# EAGLE schematic sub-unit-and-psu (EAGLE 9.6.2)
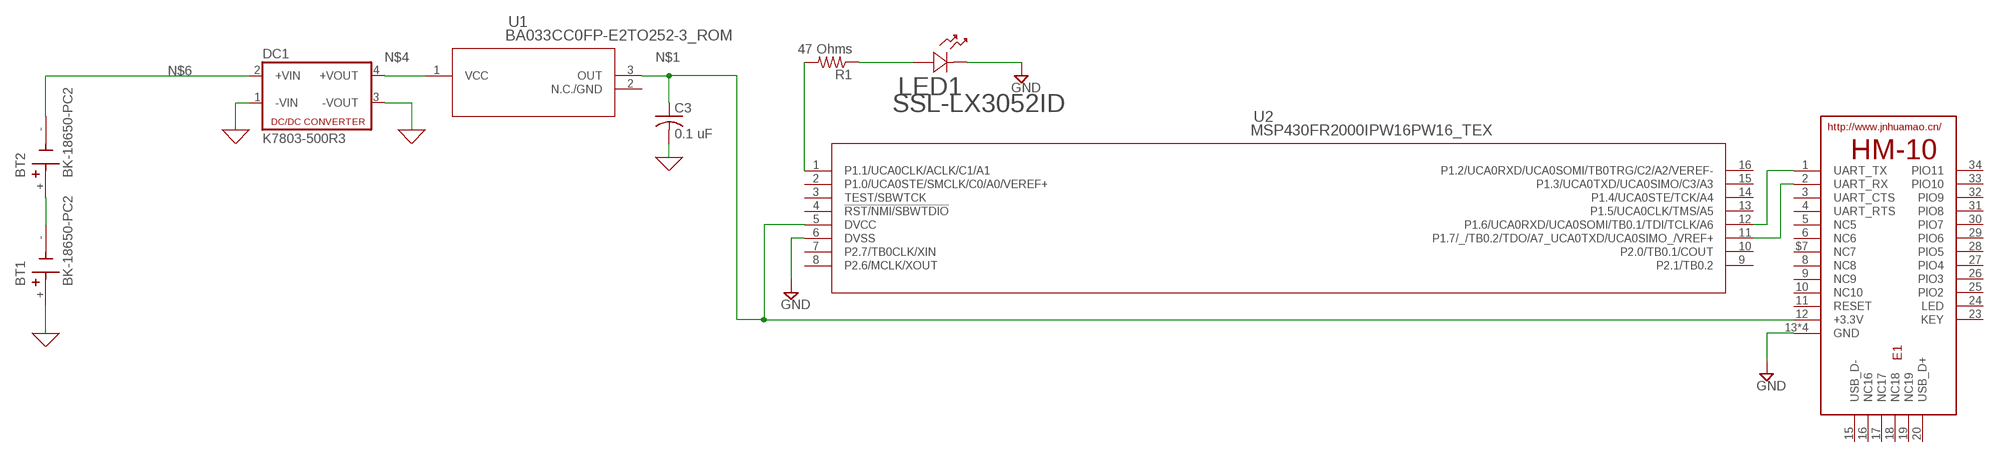
[diagram p0: schematic, sheet 1]

## Parts
BT1  BK-18650-PC2  [BAT_BK-18650-PC2]
BT2  BK-18650-PC2  [BAT_BK-18650-PC2]
C3  0.1 uF  C-US050-024X044  [C050-024X044]
DC1  K7803-500R3  NME  [NME]
E1  HM-10-BOARD  [26.9X13X2.2_BOARD]
LED1  SSL-LX3052ID  [LED_SSL-LX30_T-3_LUM]
R1  47 Ohms  R-US_0204/5  [0204/5]
U1  BA033CC0FP-E2TO252-3_ROM  [TO252-3_ROM]
U2  MSP430FR2000IPW16PW16_TEX  [PW16_TEX]

## Nets
0: BT1.+ C3.2 DC1.1(-VIN) DC1.3(-VOUT) ; supply symbol labelled GND
GND: E1.13(GND) E1.14(GND) E1.21(GND) E1.22(GND) LED1.1(ANODE) U2.6(DVSS)
N$1: C3.1 E1.12(+3.3V) U1.3(OUT) U2.5(DVCC)
N$2: BT1.- BT2.+
N$3: LED1.2 R1.1
N$4: DC1.4(+VOUT) U1.1(VCC)
N$5: E1.1(UART_TX) U2.12(P1.6/UCA0RXD/UCA0SOMI/TB0.1/TDI/TCLK/A6)
N$6: BT2.- DC1.2(+VIN)
N$7: E1.2(UART_RX) U2.11(P1.7/_/TB0.2/TDO/A7_UCA0TXD/UCA0SIMO_/VREF+)
N$8: R1.2 U2.1(P1.1/UCA0CLK/ACLK/C1/A1)
Unconnected: E1.3(UART_CTS) E1.4(UART_RTS) E1.5(NC5) E1.6(NC6) E1.8(NC8) E1.9(NC9) E1.10(NC10) E1.11(RESET) E1.15(USB_D-) E1.16(NC16) E1.17(NC17) E1.18(NC18) E1.19(NC19) E1.20(USB_D+) E1.23(KEY) E1.24(LED) E1.25(PIO2) E1.26(PIO3) E1.27(PIO4) E1.28(PIO5) E1.29(PIO6) E1.30(PIO7) E1.31(PIO8) E1.32(PIO9) E1.33(PIO10) E1.34(PIO11) E1.$7(NC7) U1.2(N.C./GND) U2.2(P1.0/UCA0STE/SMCLK/C0/A0/VEREF+) U2.3(TEST/SBWTCK) U2.4(!RST/NMI/SBWTDIO) U2.7(P2.7/TB0CLK/XIN) U2.8(P2.6/MCLK/XOUT) U2.9(P2.1/TB0.2) U2.10(P2.0/TB0.1/COUT) U2.13(P1.5/UCA0CLK/TMS/A5) U2.14(P1.4/UCA0STE/TCK/A4) U2.15(P1.3/UCA0TXD/UCA0SIMO/C3/A3) U2.16(P1.2/UCA0RXD/UCA0SOMI/TB0TRG/C2/A2/VEREF-)

## Library data of the parts
BT1 BT2 = BK-18650-PC2:BK-18650-PC2: Battery Holder (Open) 18650 1 Cell PC Pin Check availability <https://pricing.snapeda.com/parts/BK-18650-PC2/MPD%20%28Memory%20Protection%20Devices%29/view-part?ref=eda>; AVAILABILITY: In Stock; DESCRIPTION: Battery Holder (Open) 18650 1 Cell PC Pin; MF: MPD (Memory Protection Devices); MP: BK-18650-PC2; PACKAGE: None; PRICE: None; PURCHASE-URL: https://pricing.snapeda.com/search/part/BK-18650-PC2/?ref=eda
C3 = rcl:C-US: CAPACITOR, American symbol; SPICEPREFIX: C
DC1 = dc-dc-converter:NME: DC-DC CONVERTER; MF: C & D TECHNOLOGIES, INC; MPN: NME1205D; OC_FARNELL: 1021466; OC_NEWARK: 98B8198
E1 = HM-10 Bluetooth Module:HM-10: HM Bluetooth module use TI CC2540 or CC2541, Master and slave roles in one, transmission version and remote control version and PIO state acquisition functions in one, Support the AT command modify module parameters, Convenient and flexible. Check availability <https://pricing.snapeda.com/parts/HM-10/Jinan%20Huamao%20Technology/view-part?ref=eda>; AVAILABILITY: Not in stock; DESCRIPTION: Bluetooth 4.0 module with 4pin base board that can support iphone4s or later.; MF: Jinan Huamao Technology; MP: HM-10; PACKAGE: Package; PRICE: None
LED1 = Lumex SSL-LX3052ID RED LED:SSL-LX3052ID; COPYRIGHT: Copyright (C) 2023 Ultra Librarian. All rights reserved.; MANUFACTURER_PART_NUMBER: SSL-LX3052ID; MFR_NAME: Lumex
R1 = adafruit:R-US_: RESISTOR, American symbol
U1 = 2023-03-08_12-17-23_Library:BA033CC0FP-E2; COPYRIGHT: Copyright (C) 2023 Ultra Librarian. All rights reserved.; DIGI-KEY_PART_NUMBER_1: BA033CC0FP-E2TR-ND; DIGI-KEY_PART_NUMBER_2: BA033CC0FP-E2CT-ND; DIGI-KEY_PART_NUMBER_3: BA033CC0FP-E2DKR-ND; MANUFACTURER_PART_NUMBER: BA033CC0FP-E2; MFR_NAME: ROHM Semiconductor
U2 = MSP430FR2000 Sub-Unit:MSP430FR2000IPW16; COPYRIGHT: Copyright (C) 2023 Ultra Librarian. All rights reserved.; MANUFACTURER_PART_NUMBER: MSP430FR2000IPW16; MFR_NAME: Texas Instruments